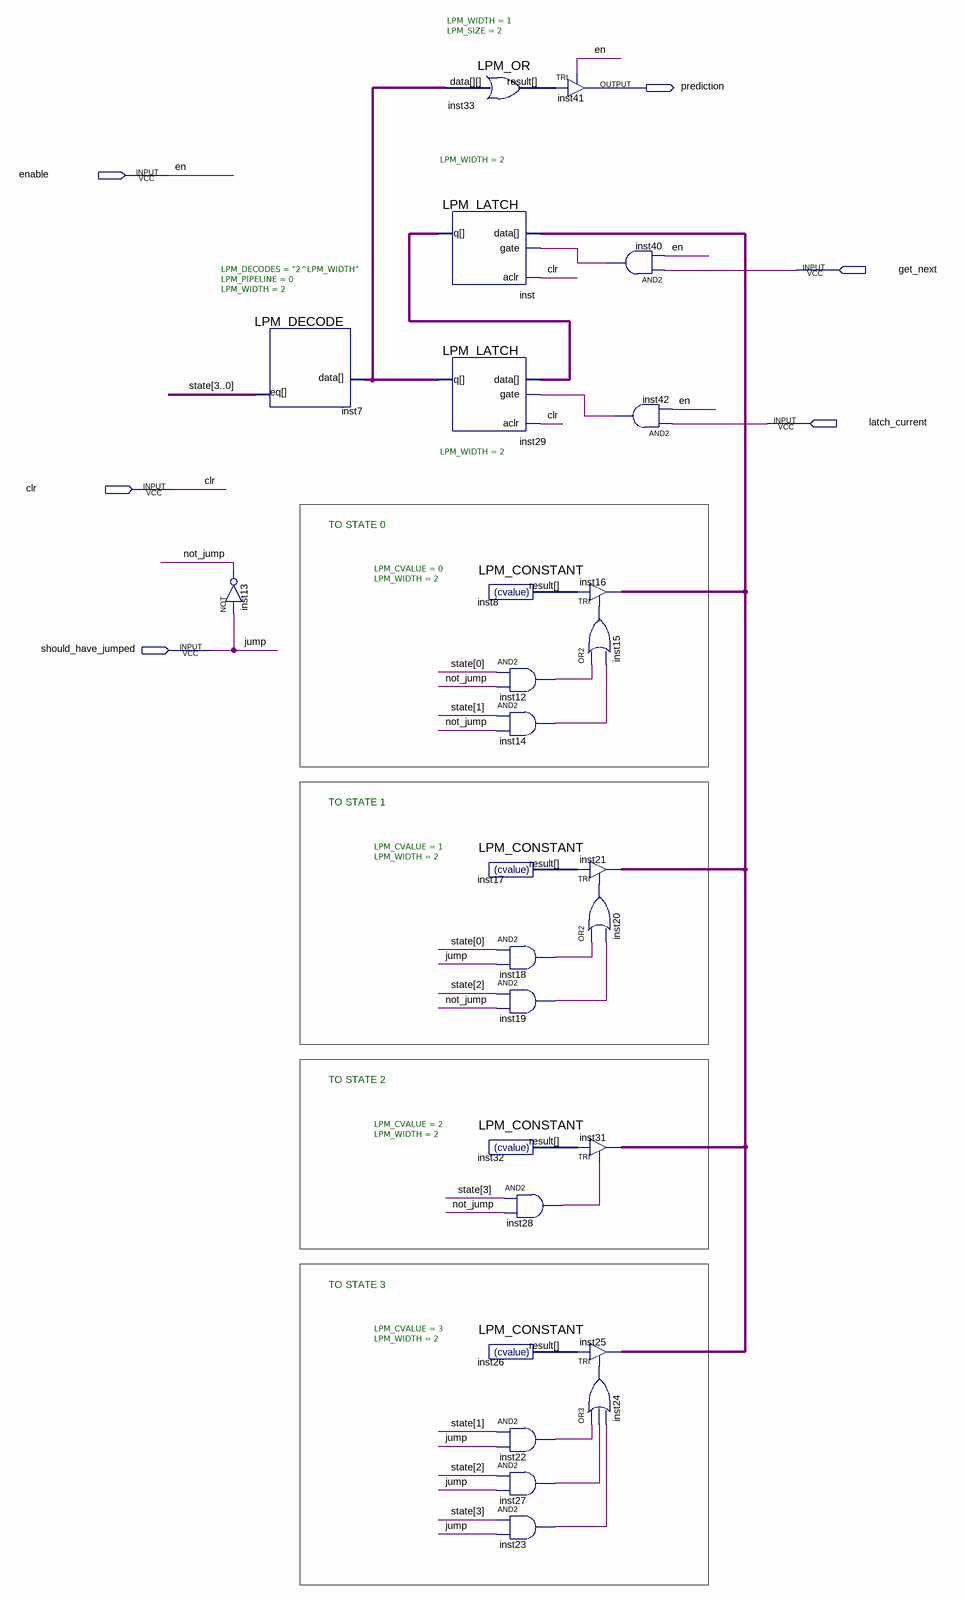
[diagram p0: schematic sheet]
// Quartus schematic A5.bdf as structural Verilog: 27 symbols, 6 pins
module A5 (
  input  enable,
  input  get_next,
  input  latch_current,
  input  clr,
  input  should_have_jumped,
  output prediction
);

  wire inst12_out, inst14_out, inst15_out, inst18_out, inst19_out, inst20_out, inst22_out, inst23_out,
       inst24_out, inst27_out, inst28_out, inst33_result, inst40_out, inst42_out, not_jump;
  wire [1:0] inst8_result, inst16_out, inst17_result, inst26_result, inst29_q, inst32_result, inst_q;
  wire [3:0] state;

  LPM_DECODE #(.LPM_DECODES("2^LPM_WIDTH"), .LPM_PIPELINE(0), .LPM_WIDTH(2)) inst7 (.data(inst29_q), .eq(state));
  not inst13 (not_jump, should_have_jumped);
  LPM_LATCH #(.LPM_WIDTH(2)) inst (.aclr(clr), .data(inst16_out), .gate(inst40_out), .q(inst_q));
  LPM_LATCH #(.LPM_WIDTH(2)) inst29 (.aclr(clr), .data(inst_q), .gate(inst42_out), .q(inst29_q));
  LPM_OR #(.LPM_WIDTH(1), .LPM_SIZE(2)) inst33 (.data(inst29_q), .result(inst33_result));
  LPM_CONSTANT #(.LPM_CVALUE(0), .LPM_WIDTH(2)) inst8 (.result(inst8_result));
  and inst12 (inst12_out, state[0], not_jump);
  and inst14 (inst14_out, state[1], not_jump);
  LPM_CONSTANT #(.LPM_CVALUE(1), .LPM_WIDTH(2)) inst17 (.result(inst17_result));
  and inst18 (inst18_out, state[0], should_have_jumped);
  and inst19 (inst19_out, state[2], not_jump);
  LPM_CONSTANT #(.LPM_CVALUE(2), .LPM_WIDTH(2)) inst32 (.result(inst32_result));
  LPM_CONSTANT #(.LPM_CVALUE(3), .LPM_WIDTH(2)) inst26 (.result(inst26_result));
  and inst22 (inst22_out, state[1], should_have_jumped);
  and inst27 (inst27_out, state[2], should_have_jumped);
  and inst23 (inst23_out, state[3], should_have_jumped);
  TRI inst41 (.IN(inst33_result), .OE(enable), .OUT(prediction));
  and inst28 (inst28_out, state[3], not_jump);
  and inst40 (inst40_out, get_next, enable);
  and inst42 (inst42_out, latch_current, enable);
  TRI inst16[1:0] (.IN(inst8_result), .OE(inst15_out), .OUT(inst16_out));
  or inst15 (inst15_out, inst12_out, inst14_out);
  TRI inst21[1:0] (.IN(inst17_result), .OE(inst20_out), .OUT(inst16_out));
  or inst20 (inst20_out, inst18_out, inst19_out);
  TRI inst31[1:0] (.IN(inst32_result), .OE(inst28_out), .OUT(inst16_out));
  TRI inst25[1:0] (.IN(inst26_result), .OE(inst24_out), .OUT(inst16_out));
  or inst24 (inst24_out, inst22_out, inst27_out, inst23_out);

  // Other names for the same wires on the sheet: en = enable; jump = should_have_jumped

  // Notes on the sheet:
  //   TO STATE 0
  //   TO STATE 1
  //   TO STATE 2
  //   TO STATE 3
endmodule
